# EAGLE design Duckuino1 (EAGLE 8.0.0)
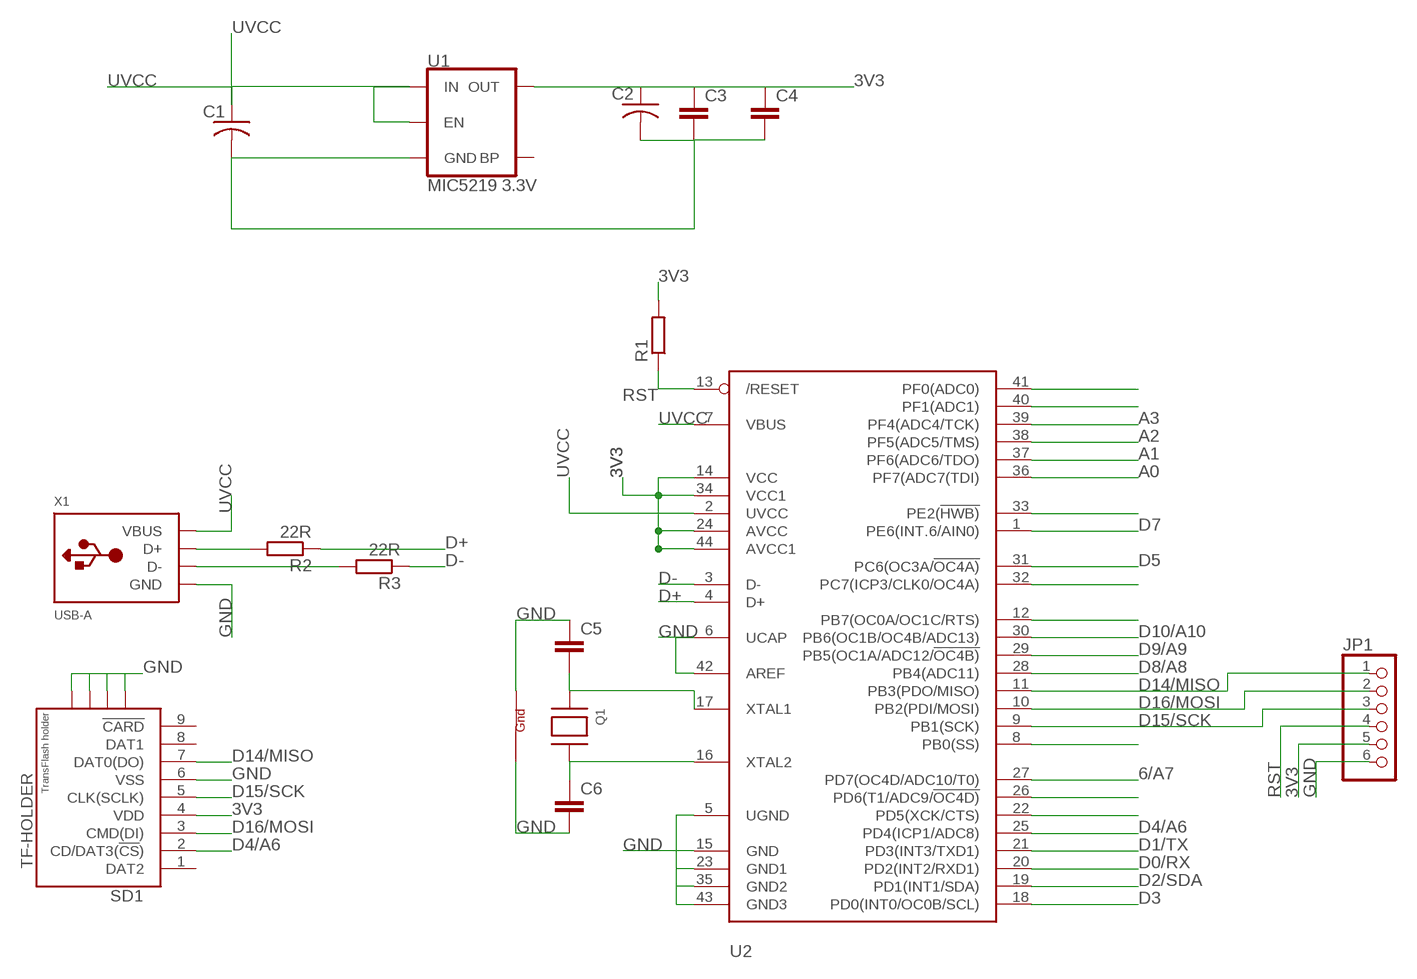
[diagram p0: schematic, sheet 1]

## Parts
C1  C-USC0603  [C0603]
C2  C-USC0603  [C0603]
C3  C-EUC0603  [C0603]
C4  C-EUC0603  [C0603]
C5  C-EUC0603  [C0603]
C6  C-EUC0603  [C0603]
JP1  PINHD-1X6  [1X06]
Q1  XTAL-4-3225  [NX3225]
R1  RR0603  [R0603]
R2  22R  RR0603  [R0603]
R3  22R  RR0603  [R0603]
SD1  TF-HOLDER  [TF-PULL]
U1  MIC5219 3.3V  V_REG_MIC52193.3V  [SOT23-5]
U2  ATMEGA32U4-AU  [TQFP44]
X1  USB-A  [MOLEX_480371000]

## Nets
3V3: C2.1 C3.1 C4.1 JP1.5 R1.2 SD1.4(VDD) U1.5(OUT) U2.14(VCC) U2.24(AVCC) U2.34(VCC1) U2.44(AVCC1)
6/A7: U2.27(PD7(OC4D/ADC10/T0))
A0: U2.36(PF7(ADC7(TDI))
A1: U2.37(PF6(ADC6/TDO))
A2: U2.38(PF5(ADC5/TMS))
A3: U2.39(PF4(ADC4/TCK))
D0/RX: U2.20(PD2(INT2/RXD1))
D1/TX: U2.21(PD3(INT3/TXD1))
D2/SDA: U2.19(PD1(INT1/SDA))
D3: U2.18(PD0(INT0/OC0B/SCL))
D4/A6: SD1.2(CD/DAT3(!CS!)) U2.25(PD4(ICP1/ADC8))
D5: U2.31(PC6(OC3A/!OC4A))
D7: U2.1(PE6(INT.6/AIN0))
D8/A8: U2.28(PB4(ADC11))
D9/A9: U2.29(PB5(OC1A/ADC12/!OC4B))
D10/A10: U2.30(PB6(OC1B/OC4B/ADC13))
D14/MISO: JP1.1 SD1.7(DAT0(DO)) U2.11(PB3(PDO/MISO))
D15/SCK: JP1.3 SD1.5(CLK(SCLK)) U2.9(PB1(SCK))
D16/MOSI: JP1.2 SD1.3(CMD(DI)) U2.10(PB2(PDI/MOSI))
D+: R2.1 U2.4(D+)
D-: R3.1 U2.3(D-)
GND: C1.2 C2.2 C3.2 C4.2 C5.1 C6.2 JP1.6 Q1.2(G2) Q1.4(G1) SD1.6(VSS) SD1.S1 SD1.S2 SD1.S3 SD1.S4 U1.2(GND) U2.5(UGND) U2.6(UCAP) U2.15(GND) U2.23(GND1) U2.35(GND2) U2.42(AREF) U2.43(GND3) X1.4(GND)
N$2: U2.41(PF0(ADC0))
N$3: R2.2 X1.3(D+)
N$4: R3.2 X1.2(D-)
N$5: C6.1 Q1.3(X2) U2.16(XTAL2)
N$6: U2.40(PF1(ADC1))
N$7: C5.2 Q1.1(X1) U2.17(XTAL1)
N$12: U2.33(PE2(!HWB))
N$15: U2.32(PC7(ICP3/CLK0/OC4A))
N$16: U2.12(PB7(OC0A/OC1C/RTS))
N$23: U2.8(PB0(SS))
N$25: U2.26(PD6(T1/ADC9/!OC4D))
N$26: U2.22(PD5(XCK/CTS))
RST: JP1.4 R1.1 U2.13(/RESET)
UVCC: C1.1 U1.1(IN) U1.3(EN) U2.2(UVCC) U2.7(VBUS) X1.1(VBUS)
Unconnected: SD1.1(DAT2) SD1.8(DAT1) SD1.9(!CARD) U1.4(BP)

## Library data of the parts
C1 C2 = rcl:C-US: CAPACITOR, American symbol
C3-C6 = rcl:C-EU: CAPACITOR, European symbol
JP1 = adafruit:PINHD-1X6: PIN HEADER
Q1 = adafruit:XTAL-4: Classic 4-pin 3.2 x 2.5mm crystal
R1-R3 = eagle-ltspice:R: RESISTOR, European symbol; SPICEMODEL: NONE; SPICEPREFIX: R
SD1 = sd:TF-HOLDER: TF / Micro SD socket is PUSH-PUSH type, the card can be pushed into and auto locked and pushed out by simply press the card. Surface Mounting type.
U1 = SparkFun-IC-Power:V_REG_MIC5219: V_REG MIC5219 Standard 3.3V and 5V 500mA LDO voltage regulator in SOT-23 layout. Micrel part MIC5219. BP (by-pass) pin is used to lower output noise with 470pF cap, may be left open.; PROD_ID: VREG-09872
U2 = adafruit:ATMEGA32U4: http://www.ladyada.net/library/eagle
X1 = adafruit:USB-A: USB type A 'plug' Used for things that can directly connect to a USB port, say USB key

## Board
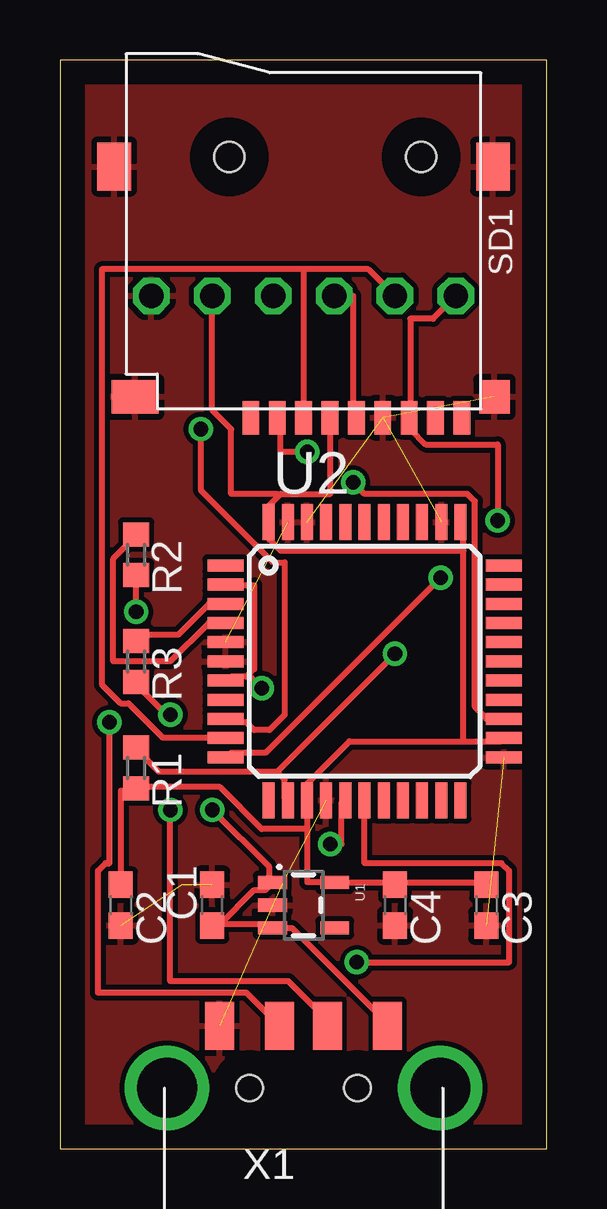
[diagram p1: board, top side]
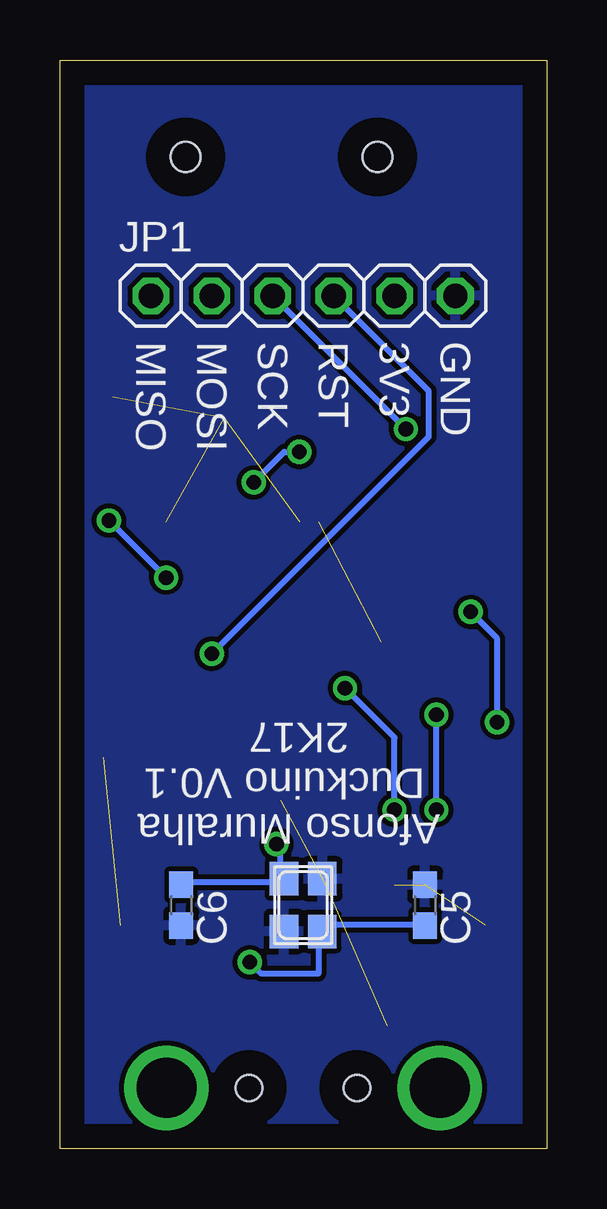
[diagram p2: board, bottom side, seen from below]

Size 20.3 x 45.39 mm. Coordinates in mm from the lower left corner, seen from the top.
Outline: 0,0 20.3,0 20.3,45.39 0,45.39 0,0
Copper layers (1*16): Top 0.035mm / dielectric 1.5mm / Bottom 0.035mm
Design rules "default": minimum track width 10mil, minimum drill 24mil, track to track 8mil, track to pad 8mil, pad to pad 8mil, via to via 8mil, smd to smd 8mil, copper to edge 40mil, drill to drill 8mil, minimum pad ring 10mil, minimum via ring 8mil, stop-mask expansion 4mil, vias tented up to drill 0mil, thermal gap 10mil

### Footprints (pad centres in the part's own frame; a part is rotated, then mirrored left to right if it is on the bottom)
C0603 = smd 1.1 x 1: 1 -0.85,0; 2 0.85,0
1X06 = drill 1.016 octagon: 1 -6.35,0; 2 -3.81,0; 3 -1.27,0; 4 1.27,0; 5 3.81,0; 6 6.35,0
NX3225 = smd 1.4 x 1.2: 1 -1.1,-0.8; 2 1.1,-0.8; 3 1.1,0.8; 4 -1.1,0.8
R0603 = smd 1 x 1.1: 1 -0.85,0; 2 0.85,0
TF-PULL = smd 0.7 x 1.4: 1 -2.2,-7.62; 2 -1.1,-7.62; 3 0,-7.62; 4 1.1,-7.62; 5 2.2,-7.62; 6 3.3,-7.62; 7 4.4,-7.62; 8 5.5,-7.62; 9 6.6,-7.62 | smd 1.4 x 2: S1 -7.9,2.85; S2 7.9,2.85 | smd 1.28 x 1.4: S3 7.96,-6.75 | smd 1.95 x 1.4: S4 -7.025,-6.75 | hole 1.25: -3.1,3.25; 4.9,3.25
SOT23-5 = smd 0.55 x 1.2: 1 -0.95,-1.3; 2 0,-1.3; 3 0.95,-1.3; 4 0.95,1.3; 5 -0.95,1.3
TQFP44 = smd 1.5 x 0.5: 1 -5.8,4; 2 -5.8,3.2; 3 -5.8,2.4; 4 -5.8,1.6; 5 -5.8,0.8; 6 -5.8,0; 7 -5.8,-0.8; 8 -5.8,-1.6; 9 -5.8,-2.4; 10 -5.8,-3.2; 11 -5.8,-4; 23 5.8,-4; 24 5.8,-3.2; 25 5.8,-2.4; 26 5.8,-1.6; 27 5.8,-0.8; 28 5.8,0; 29 5.8,0.8; 30 5.8,1.6; 31 5.8,2.4; 32 5.8,3.2; 33 5.8,4 | smd 0.5 x 1.5: 12 -4,-5.8; 13 -3.2,-5.8; 14 -2.4,-5.8; 15 -1.6,-5.8; 16 -0.8,-5.8; 17 0,-5.8; 18 0.8,-5.8; 19 1.6,-5.8; 20 2.4,-5.8; 21 3.2,-5.8; 22 4,-5.8; 34 4,5.8; 35 3.2,5.8; 36 2.4,5.8; 37 1.6,5.8; 38 0.8,5.8; 39 0,5.8; 40 -0.8,5.8; 41 -1.6,5.8; 42 -2.4,5.8; 43 -3.2,5.8; 44 -4,5.8
MOLEX_480371000 = smd 1.2 x 2: 1 3.5,2.6; 2 1,2.6; 3 -1,2.6; 4 -3.5,2.6 | drill 2.5: M1 -5.7,0; M2 5.7,0 | hole 1.1: -2.25,0; 2.25,0

### Placement (x,y rotation side)
C1  6.35,10.16 90 top
C2  2.54,10.16 270 top
C3  17.78,10.16 270 top
C4  13.97,10.16 270 top
C5  5.08,10.16 270 bottom
C6  15.24,10.16 270 bottom
JP1  10.16,35.56 0 bottom
Q1  10.16,10.16 90 bottom
R1  3.17,15.88 270 top
R2  3.17,24.77 270 top
R3  3.17,20.32 270 top
SD1  10.16,38.1 0 top
U1  10.16,10.16 270 top
U2  12.7,20.32 0 top
X1  10.16,2.54 0 top

### Tracks (layer width: path | path; a pad name or v marks a point on that pad's centre or on a via)
3V3
  Top 0.254: 9.13,27.23 8.73,26.83 8.73,26.19 U2.44 8.73,26.04 8.73,25.4 9.21,24.92 16.83,24.92 | 9.13,27.23 9.21,27.3 11.27,27.3 11.27,30.48 SD1.4 | JP1.5 6.35,30.8 7.14,30 7.14,27.3 9.05,27.3 9.13,27.23 | C2.1 2.54,14.92 3.17,14.92 R1.2 3.17,15.08 6.67,15.08 8.41,13.34 10.32,13.34 | 13.97,11.11 11.59,11.11 U1.5 11.43,11.11 10.32,11.11 10.32,13.34 | 13.97,11.11 17.78,11.11 C3.1 | 13.97,11.11 C4.1 | 10.32,13.34 10.32,14.45 U2.14 10.32,14.61 10.32,15.24 12.06,16.99 16.83,16.99 | 16.83,16.99 18.41,16.99 U2.24 | 16.83,16.99 16.83,24.92 | 16.83,24.92 16.83,26.04 U2.34
D4/A6  (via drill 0.61)
  Top 0.254: v10.32,29.05 9.21,29.05 9.21,30.48 SD1.2 | v12.22,27.78 12.7,27.3 16.99,27.3 17.3,26.99 17.3,18.41 17.78,17.94 18.41,17.94 U2.25
  Bottom 0.254: v10.32,29.05 10.95,29.05 v12.22,27.78
D14/MISO  (via drill 0.61)
  Top 0.254: 14.61,30.48 14.61,34.61 15.56,34.61 JP1.1 | v15.88,23.81 8.57,16.51 7.14,16.51 6.99,16.35 U2.11 | v18.26,26.19 18.26,29.37 15.24,29.37 14.61,30 14.61,30.48 | 14.61,30.48 SD1.7
  Bottom 0.254: v18.26,26.19 v15.88,23.81
D15/SCK  (via drill 0.61)
  Top 0.254: JP1.3 12.22,35.56 12.22,30.48 SD1.5 | v5.87,30 5.87,27.46 8.89,24.45 9.37,24.45 9.37,18.1 8.73,17.46 8.1,17.46 7.78,17.78 6.99,17.78 U2.9
  Bottom 0.254: JP1.3 v5.87,30
D16/MOSI
  Top 0.254: 10.16,36.67 SD1.3 | 10.16,36.67 12.86,36.67 JP1.2 | 10.16,36.67 1.75,36.67 1.75,19.37 2.54,18.57 2.86,18.57 4.29,17.14 6.83,17.14 U2.10
D+
  Top 0.254: R2.1 3.17,25.56 2.22,24.61 2.22,20.32 4.6,20.32 6.19,21.91 6.83,21.91 U2.4
D-
  Top 0.254: R3.1 3.17,21.27 3.33,21.43 4.92,21.43 6.19,22.7 6.83,22.7 U2.3
GND  (10 unrouted)
  pour Top: 0,0 20.32,0 20.32,45.72 0,45.72
  pour Bottom: 0,0 20.32,0 20.32,45.72 0,45.72
  pour Bottom: 0,45.72 0,0 20.32,0 20.32,45.72
N$3  (via drill 0.61)
  Top 0.254: v3.17,22.38 R2.2 | v2.06,17.78 2.06,11.91 1.91,11.91 1.59,11.59 1.59,6.51 7.78,6.51 9.05,5.24 X1.3
  Bottom 0.254: v3.17,22.38 2.06,21.27 v2.06,17.78
N$4  (via drill 0.61)
  Top 0.254: v4.6,18.1 4.45,18.1 3.17,19.37 R3.2 | v4.6,14.13 4.6,6.99 9.53,6.99 11.27,5.24 X1.2
  Bottom 0.254: v4.6,14.13 v4.6,18.1
N$5  (via drill 0.61)
  Top 0.254: v11.27,12.7 11.75,12.7 11.75,14.45 U2.16
  Bottom 0.254: C6.1 15.24,11.11 11.11,11.11 Q1.3 11.11,11.27 11.11,12.54 v11.27,12.7
N$7  (via drill 0.61)
  Top 0.254: U2.17 12.7,11.91 18.41,11.91 18.73,11.59 18.73,7.78 v12.38,7.78
  Bottom 0.254: C5.2 5.08,9.37 9.21,9.37 9.21,9.21 Q1.1 9.37,9.05 9.53,8.89 9.53,7.3 11.91,7.3 v12.38,7.78
RST  (via drill 0.61)
  Top 0.254: 9.05,15.72 4.13,15.72 3.17,16.67 R1.1 | 9.05,15.72 9.37,15.4 9.37,14.61 U2.13 | 9.05,15.72 v13.97,20.64
  Bottom 0.254: JP1.4 4.92,31.59 4.92,29.69 v13.97,20.64
UVCC  (via drill 0.61)
  Top 0.254: 7.86,19.76 8.1,20 8.1,23.5 6.99,23.5 U2.2 | 7.86,19.76 7.78,19.68 7.14,19.68 6.99,19.53 U2.7 | 6.67,9.37 8.73,9.37 U1.3 8.89,9.21 9.68,9.21 13.65,5.24 X1.1 | 6.67,9.37 6.35,9.37 C1.1 6.67,9.37 | 6.67,9.37 8.1,10.79 8.57,10.79 8.73,10.95 U1.1 8.73,11.11 8.73,11.75 v6.35,14.13 | v8.41,19.21 7.86,19.76
  Bottom 0.254: v8.41,19.21 6.35,17.14 v6.35,14.13

### Text on the board
bPlace: GND | 3V3 | RST | SCK | MOSI | MISO | 2K17 | Duckuino V0.1 | Afonso Muralha